# EAGLE design db9tg (EAGLE 9.0.0)
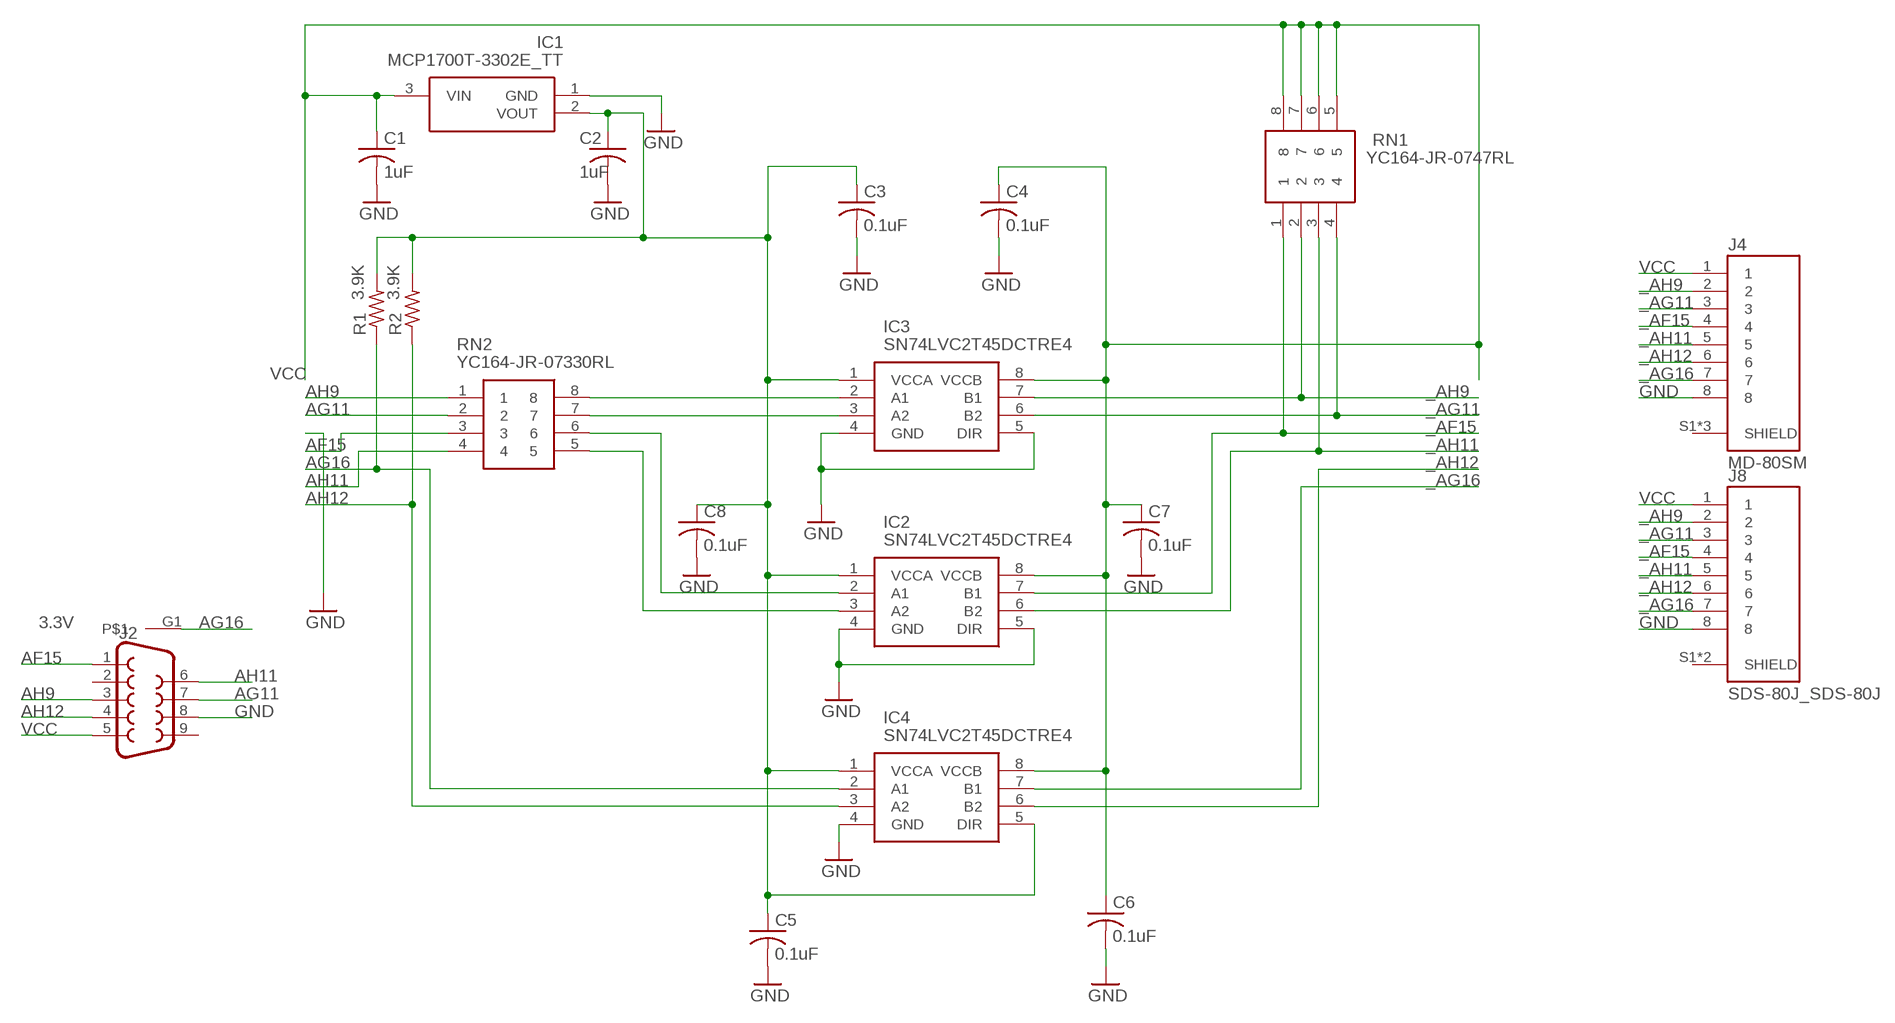
[diagram p0: schematic, sheet 1]

## Parts
C1  1uF  C-USC0603  [C0603]
C2  1uF  C-USC0603  [C0603]
C3  0.1uF  C-USC0402  [C0402]
C4  0.1uF  C-USC0402  [C0402]
C5  0.1uF  C-USC0402  [C0402]
C6  0.1uF  C-USC0402  [C0402]
C7  0.1uF  C-USC0402  [C0402]
C8  0.1uF  C-USC0402  [C0402]
IC1  MCP1700T-3302E_TT  [SOT95P237X112-3N]
IC2  SN74LVC2T45DCTRE4  [SOP65P400X130-8N]
IC3  SN74LVC2T45DCTRE4  [SOP65P400X130-8N]
IC4  SN74LVC2T45DCTRE4  [SOP65P400X130-8N]
J2  DB9FEMALE  [DB9]
J4  MD-80SM  [CUI_MD-80SM]
J8  SDS-80J_SDS-80J  [SDS-80J_CUI_SDS-80J]
R1  3.9K  R-US_R0402  [R0402]
R2  3.9K  R-US_R0402  [R0402]
RN1  YC164-JR-0747RL  YC164-JR-07330RL  [YC164JR07220RL]
RN2  YC164-JR-07330RL  [YC164JR07220RL]

## Nets
3V3: C2.1 C3.1 C5.1 C8.1 IC1.2(VOUT) IC2.1(VCCA) IC3.1(VCCA) IC4.1(VCCA) IC4.5(DIR) R1.2 R2.2
_AF15: IC2.7(B1) J4.4 J8.4 RN1.1
_AG11: IC3.6(B2) J4.3 J8.3 RN1.4
_AG16: IC4.7(B1) J4.7 J8.7
_AH9: IC3.7(B1) J4.2 J8.2 RN1.2
_AH11: IC2.6(B2) J4.5 J8.5 RN1.3
_AH12: IC4.6(B2) J4.6 J8.6
AF15: J2.1 RN2.3
AG11: J2.7 RN2.2
AG16: IC4.2(A1) J2.G1 R1.1
AH9: J2.3 RN2.1
AH11: J2.6 RN2.4
AH12: IC4.3(A2) J2.4 R2.1
GND [power]: C1.2 C2.2 C3.2 C4.2 C5.2 C6.2 C7.2 C8.2 IC1.1(GND) IC2.4(GND) IC2.5(DIR) IC3.4(GND) IC3.5(DIR) IC4.4(GND) J2.8 J4.8 J8.8
N$4: IC3.3(A2) RN2.7
N$6: IC3.2(A1) RN2.8
N$13: IC2.2(A1) RN2.6
N$16: IC2.3(A2) RN2.5
VCC: C1.1 C4.1 C6.1 C7.1 IC1.3(VIN) IC2.8(VCCB) IC3.8(VCCB) IC4.8(VCCB) J2.5 J4.1 J8.1 RN1.5 RN1.6 RN1.7 RN1.8
Unconnected: J2.2 J2.9 J4.S1(SHIELD) J4.S2(SHIELD) J4.S3(SHIELD) J8.S1(SHIELD) J8.S2(SHIELD)

## Library data of the parts
C1 C2 = rcl:C-US: CAPACITOR, American symbol; SPICEPREFIX: C
C3-C8 = resistor:C-US: CAPACITOR, American symbol
IC1 = PC-Engine:MCP1700T-3302E_TT: LDO voltage regulator 250mA Isupply 1uA Source: Datasheet <http://docs-emea.rs-online.com/webdocs/0dd1/0900766b80dd189b.pdf>; ARROW_PART_NUMBER: MCP1700T-3302E/TT; ARROW_PRICE-STOCK: https://www.arrow.com/en/products/mcp1700t-3302ett/microchip-technology; DESCRIPTION: LDO voltage regulator 250mA Isupply 1uA; HEIGHT: 1.12mm; MANUFACTURER_NAME: Microchip; MANUFACTURER_PART_NUMBER: MCP1700T-3302E/TT; MOUSER_PART_NUMBER: 579-MCP1700T3302E/TT; MOUSER_PRICE-STOCK: https://www.mouser.co.uk/ProductDetail/Microchip-Technology/MCP1700T-3302E-TT?qs=fM4xO01eazPmCNDrdHEdaw%3D%3D
IC2-IC4 = PC-Engine:SN74LVC2T45DCTRE4: Translation - Voltage Levels DUAL-BIT DUAL SUPPLY TRANSCEIVER Source: Datasheet <http://www.ti.com/lit/ds/symlink/sn74lvc2t45.pdf>; ARROW_PART_NUMBER: SN74LVC2T45DCTRE4; ARROW_PRICE-STOCK: https://www.arrow.com/en/products/sn74lvc2t45dctre4/texas-instruments; DESCRIPTION: Translation - Voltage Levels DUAL-BIT DUAL SUPPLY TRANSCEIVER; HEIGHT: 1.3mm; MANUFACTURER_NAME: Texas Instruments; MANUFACTURER_PART_NUMBER: SN74LVC2T45DCTRE4; MOUSER_PART_NUMBER: 595-SN74LVC2T45DCTE4; MOUSER_PRICE-STOCK: https://www.mouser.co.uk/ProductDetail/Texas-Instruments/SN74LVC2T45DCTRE4?qs=0smPjiIwnfKw%252BKTYvzl10g%3D%3D
J2 = SparkFun-Connectors:DB9: DB9 Connector Standard DB9 (D-Sub 9) serial connector. Can be used for CAN bus as well as RS485 and RS232. Footprint production proven. Here is the female version connector we sell at SparkFun: 9 Pin Female Serial Connector - PCB Mount <https://www.sparkfun.com/products/429> (PRT-00429) This connector has been used on the following SparkFun products: SparkFun RS232 Shifter - SMD <https://www.sparkfun.com/products/449> (PRT-00449) SparkFun RS232 Shifter SMD (No DB9) <https://www.sparkfun.com/products/8780> (PRT-08780); PROD_ID: CONN-08194
J4 = MD-80SM-edit:MD-80SM: MD-XXSM Series 8 Pin Female Right Angle Shielded Side Mini DIN Connector; CUI_PURCHASE_URL: https://www.cui.com/product/interconnect/connectors/din-connectors/md-sm-series?utm_source=snapeda.com&utm_medium=referral&utm_campaign=snapedaBOM; DESCRIPTION: 3~9 Positions, Receptacle, Right Angle, Through Hole, Shielded, Mini Circular DIN Connector; DIGI-KEY_PART_NUMBER: CP-2280-ND; DIGI-KEY_PURCHASE_URL: https://www.digikey.com/product-detail/en/cui-inc/MD-80SM/CP-2280-ND/96944?utm_source=snapeda&utm_medium=aggregator&utm_campaign=symbol; MF: CUI Inc.; MP: MD-80SM; PACKAGE: None
J8 = db9tg:SDS-80J_SDS-80J: Standard Din Connector 8 Pin, Right-Angle Receptacle; AVAILABILITY: Unavailable; CUI_PURCHASE_URL: https://www.cui.com/product/interconnect/connectors/din-connectors/sds-j-series?utm_source=snapeda.com&utm_medium=referral&utm_campaign=snapedaBOM; DESCRIPTION: 3~13 Positions, Receptacle, Right Angle, Through Hole, Standard Circular DIN Connector; MF: CUI Inc.; MP: SDS-80J; PACKAGE: None; PRICE: None
R1 R2 = resistor:R-US_: RESISTOR, American symbol
RN1 RN2 = SamacSys_Parts:YC164-JR-07330RL: YAGEO - YC164-JR-07330RL - RESISTOR ARRAY, ARV241 1206 330R Source: Datasheet <https://media.digikey.com/pdf/Data Sheets/Yageo PDFs/YC102-358,TC122-164_Series_DS.pdf>; DESCRIPTION: YAGEO - YC164-JR-07330RL - RESISTOR ARRAY, ARV241 1206 330R; HEIGHT: 0mm; MANUFACTURER_NAME: YAGEO (PHYCOMP); MANUFACTURER_PART_NUMBER: YC164-JR-07330RL; MOUSER_PART_NUMBER: 603-YC164-JR-07330RL; MOUSER_PRICE-STOCK: https://www.mouser.com/Search/Refine.aspx?Keyword=603-YC164-JR-07330RL

## Net classes
1 power: width 0.305 mm

## Board
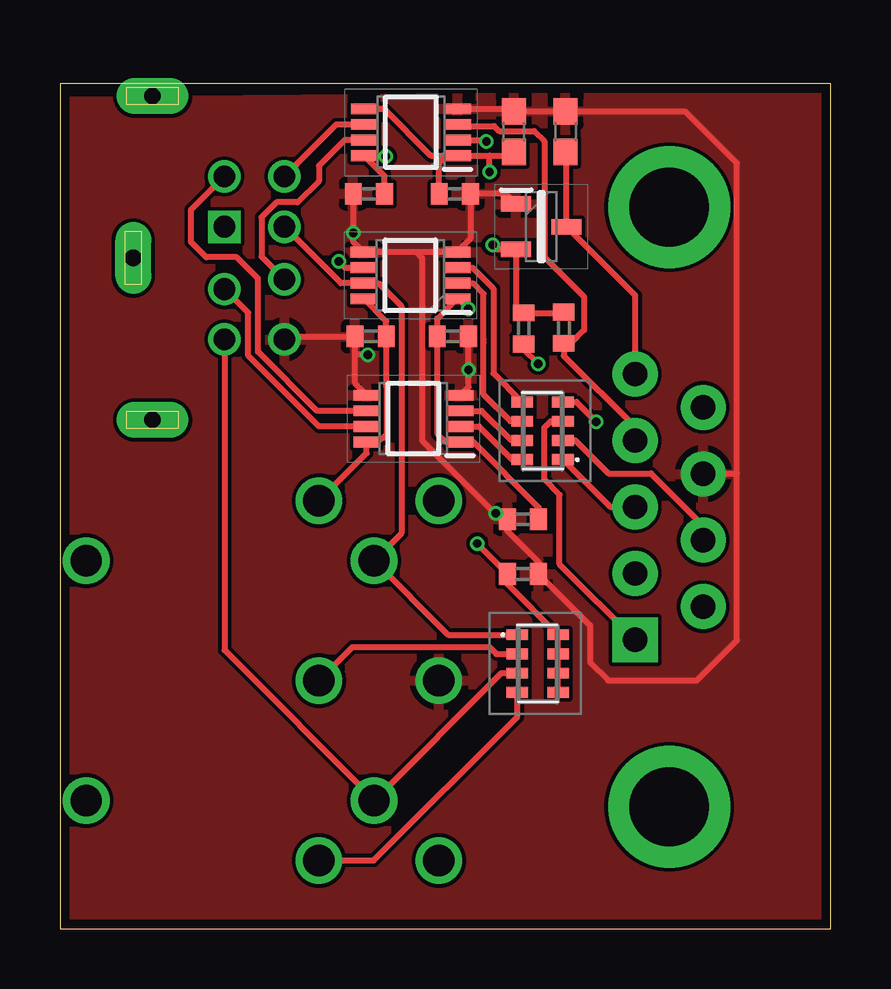
[diagram p1: board, top side]
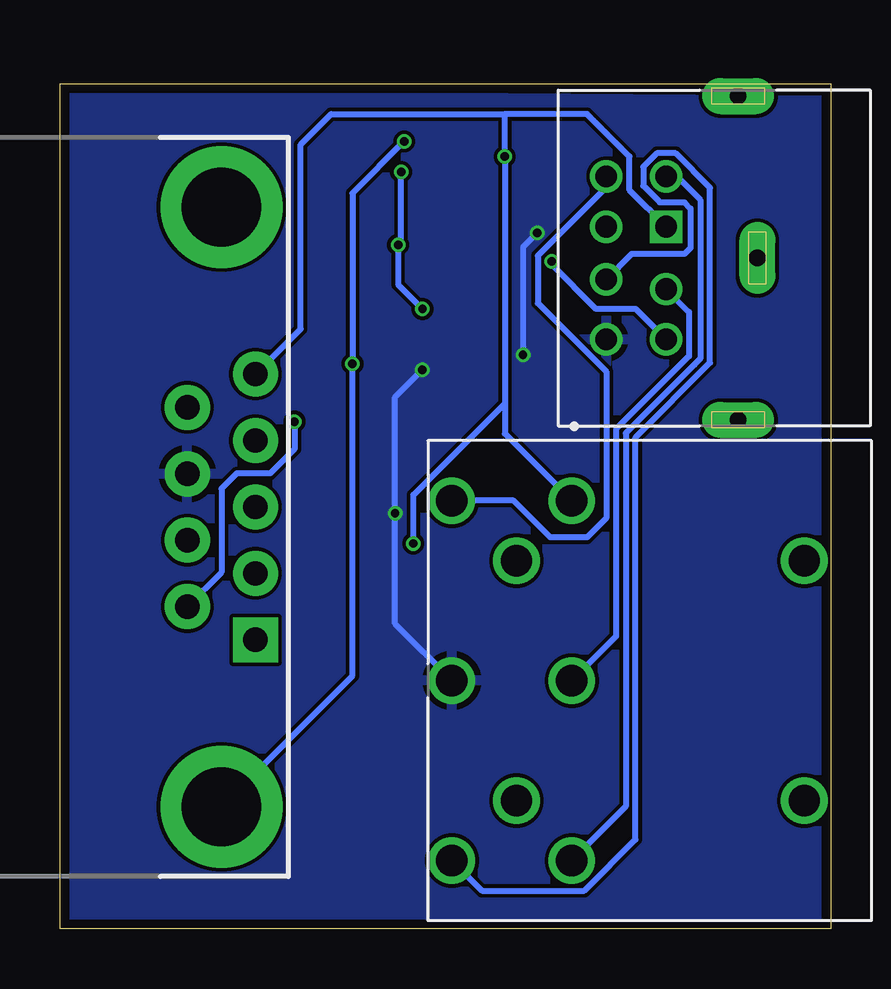
[diagram p2: board, bottom side, seen from below]

Size 32.13 x 35.23 mm. Coordinates in mm from the lower left corner, seen from the top.
Outline: 32.13,35.23 0,35.23 0,0 32.13,0 32.13,35.23
Copper layers (1*16): Top 0.035559375mm / dielectric 1.6mm / Bottom 0.035559375mm
Design rules "oshpark-2layer *": minimum track width 6mil, minimum drill 10mil, track to track 6mil, track to pad 6mil, pad to pad 6mil, via to via 6mil, smd to smd 6mil, copper to edge 15mil, drill to drill 6mil, minimum pad ring 5mil, minimum via ring 5mil, stop-mask expansion 2.5mil, vias tented up to drill 15mil, thermal gap 10mil

### Footprints (pad centres in the part's own frame; a part is rotated, then mirrored left to right if it is on the bottom)
C0603 = smd 1.1 x 1: 1 -0.85,0; 2 0.85,0
C0402 = smd 0.7 x 0.9: 1 -0.65,0; 2 0.65,0
SOT95P237X112-3N = smd 1.25 x 0.65: 1 -1.05,0.95; 2 -1.05,-0.95; 3 1.05,0
SOP65P400X130-8N = smd 1.1 x 0.45: 1 -1.95,0.975; 2 -1.95,0.325; 3 -1.95,-0.325; 4 -1.95,-0.975; 5 1.95,-0.975; 6 1.95,-0.325; 7 1.95,0.325; 8 1.95,0.975
DB9 = drill 1.016 pad 1.88 square: 1 -5.54,-1.42 | drill 1.016 pad 1.88: 2 -2.77,-1.42; 3 0,-1.42; 4 2.77,-1.42; 5 5.54,-1.42; 6 -4.15,1.42; 7 -1.38,1.42; 8 1.38,1.42; 9 4.15,1.42 | drill 3.302 pad 5.08: G1 -12.5,0; G2 12.5,0
CUI_MD-80SM = drill 0.9 square: 1 0,0 | drill 0.9: 2 2.6,0; 3 -2.1,0; 4 0,-2.5; 5 4.7,0; 6 -2.1,-2.5; 7 2.2,-2.5; 8 4.7,-2.5 | drill 0.7 pad 1.5 long: S1 -5.45,3; S2 8.05,3; S3 1.3,3.8
SDS-80J_CUI_SDS-80J = drill 1.3: 1 7.5,0; 2 0,0; 3 -7.5,0; 4 5,2.3; 5 -5,2.3; 6 7.5,5; 7 -7.5,5; 8 0,5; S1 -5,-9.7; S2 5,-9.7
R0402 = smd 0.7 x 0.9: 1 -0.65,0; 2 0.65,0
YC164JR07220RL = smd 0.45 x 0.9: 1 -1.2,-0.85; 2 -0.4,-0.85; 3 0.4,-0.85; 4 1.2,-0.85; 5 1.2,0.85; 6 0.4,0.85; 7 -0.4,0.85; 8 -1.2,0.85

### Placement (x,y rotation side)
C1  21.08,33.22 90 top
C2  18.92,33.22 90 top
C3  19.3,17.07 180 top
C4  19.3,14.78 0 top
C5  16.46,30.63 0 top
C6  12.88,30.63 180 top
C7  12.95,24.69 180 top
C8  16.38,24.69 0 top
IC1  20.07,29.26 0 top
IC2  14.61,27.23 180 top
IC3  14.73,21.26 180 top
IC4  14.63,33.2 180 top
J2  25.4,17.58 90 bottom
J4  6.86,29.26 270 bottom
J8  10.8,10.34 90 bottom
R1  19.33,25.02 90 top
R2  21.01,25.04 90 top
RN1  19.91,11.05 270 top
RN2  20.12,20.75 90 top

### Tracks (layer width: path | path; a pad name or v marks a point on that pad's centre or on a via)
3V3  (via drill 0.35)
  Top 0.254: IC4.5 13.5,34.17 15.45,32.22 16.13,32.22 | 16.13,32.22 IC4.1 17.91,32.22 | 17.91,32.22 18.77,32.22 C2.1 | R2.2 20.98,25.67 R1.2 19.02,25.98 IC1.2 18.22,28.31 v18.03,28.5 | C5.1 15.81,31.9 16.13,32.22 | C3.1 19.95,17.56 17.23,20.29 IC3.1 16.09,20.29 15.75,20.62 15.75,24.67 C8.1 15.73,25.43 IC2.1 16.6,26.25 v17.02,25.83 | v17.91,31.55 17.91,32.22
  Bottom 0.254: v17.91,31.55 17.91,28.63 v18.03,28.5 18.03,26.85 v17.02,25.83
_AF15
  Top 0.254: J4.4 11.71,26.9 IC2.7 13.28,26.9 14.23,25.95 14.23,16.48 J8.4 16.18,12.25 RN1.1
_AG11
  Top 0.254: J8.3 13.07,2.84 19.06,8.83 RN1.4 | IC3.6 10.72,21.59 8.25,24.05 8.25,27.1 7.37,27.99 6.1,27.99 5.46,28.63 5.46,29.96 J4.3
  Bottom 0.254: J8.3 8.55,5.09 8.55,20.65 5.68,23.51 5.5,23.7 5.44,23.76 5.44,30.38 6.42,31.36 J4.3
_AG16
  Top 0.254: IC4.7 11.87,32.87 10.8,31.8 10.8,31.17 9.91,30.28 9.02,30.28 8.4,29.66 8.4,28.02 J4.7
  Bottom 0.254: J4.7 8.3,28.12 6.1,28.12 5.84,28.37 5.84,30.02 6.1,30.28 7.12,30.28 7.81,30.97 7.81,31.76 7.25,32.31 6.46,32.31 5.03,30.88 5.03,23.59 8.14,20.48 8.14,3.72 10.27,1.58 14.54,1.58 J8.7
_AH9
  Top 0.254: J8.2 12.19,11.73 17.91,11.73 18.19,11.45 RN1.2 | IC3.7 10.8,20.94 7.85,23.89 7.85,25.67 J4.2
  Bottom 0.254: J4.2 5.9,25.71 5.9,23.87 8.95,20.82 8.95,12.18 J8.2
_AH11  (via drill 0.35)
  Top 0.254: J8.5 13.11,5.36 | 13.11,5.36 18.41,10.65 RN1.3 | v11.63,27.81 11.89,27.55 IC2.6 | J4.5 6.86,11.61 13.11,5.36
  Bottom 0.254: J4.5 8.13,25.83 9.78,25.83 11.63,27.68 v11.63,27.81
_AH12
  Top 0.254: IC4.6 11.52,33.52 J4.6
  Bottom 0.254: J4.6 9.36,30.91 12.21,28.05 12.21,26.06 9.36,23.21 9.36,17.11 10.16,16.31 11.68,16.31 13.21,17.84 J8.6
AF15
  Top 0.254: J2.1 20.83,15.19 20.83,18.09 20.19,18.72 20.19,20.88 20.47,21.15 RN2.3
AG11
  Top 0.254: RN2.2 21.48,20.35 22.86,18.97 24.64,18.97 26.82,16.79 J2.7
AG16  (via drill 0.35)
  Top 0.254: IC4.2 17.72,32.87 v17.78,32.82 | v19.94,23.55 19.33,24.16 R1.1
  Bottom 0.254: v17.78,32.82 19.94,30.66 v19.94,23.55 19.94,10.54 J2.G1
AH9
  Top 0.254: RN2.1 22.94,17.58 J2.3
AH11  (via drill 0.35)
  Top 0.254: RN2.4 21.53,21.95 v22.35,21.13
  Bottom 0.254: v22.35,21.13 22.35,19.99 23.37,18.97 24.77,18.97 25.4,18.34 25.4,14.85 J2.6
AH12
  Top 0.254: J2.4 23.98,20.9 21.01,23.88 R2.1 21.3,24.4 21.84,24.94 21.84,26.34 20.19,27.99 20.19,32.82 19.77,33.24 18.31,33.24 18.1,33.45 16.65,33.45 IC4.3
GND  (via drill 0.35)
  Top 0.254: IC4.4 18.82,34.17 C2.2 C1.2 26.05,34.07 28.22,31.9 28.22,18.97 | IC1.1 18.59,30.63 C5.2 17.11,28.76 IC2.4 14.86,28.2 | 14.86,28.2 IC2.5 12.23,28.63 v12.23,29.01 C6.2 | IC3.5 12.3,22.71 12.3,23.93 | 12.3,23.93 C7.2 9.49,24.69 J4.8 | IC3.4 17.03,22.59 v17.03,23.29 C8.2 | 14.86,28.2 15.1,27.96 15.1,20.34 18.01,17.43 18.12,17.32 | v12.83,23.93 12.3,23.93 | 18.12,17.32 18.37,17.07 C3.2 18.65,16.58 19.95,15.28 C4.2 22.1,12.64 22.1,11.1 22.86,10.34 26.54,10.34 28.22,12.01 28.22,18.97 | J2.8 26.84,18.97 28.22,18.97 | 18.12,17.32 v18.16,17.32
  Bottom 0.254: v12.23,29.01 12.83,28.41 v12.83,23.93 | J8.8 18.16,12.7 v18.16,17.32 18.16,22.16 v17.03,23.29
  pour Bottom: 31.7,0.44 0.55,0.38 0.43,34.52 31.71,34.76
  pour Top: 31.77,34.77 31.75,0.48 0.52,0.51 0.4,34.5
N$4
  Top 0.254: IC3.3 17.58,21.59 18.81,20.35 RN2.7
N$6
  Top 0.254: IC3.2 17.47,20.94 18.85,19.55 RN2.8
N$13
  Top 0.254: IC2.2 17.22,26.9 17.66,26.46 17.66,24.56 17.66,24.44 17.66,22.27 18.78,21.15 RN2.6
N$16
  Top 0.254: IC2.3 17.2,27.55 18.07,26.69 18.07,23.15 RN2.5
VCC  (via drill 0.35)
  Top 0.254: C1.1 21.12,32.34 IC1.3 23.98,26.4 J2.5 | IC2.8 13.6,25.3 C7.1 13.6,22.58 13.61,22.58 13.61,20.59 13.45,20.43 13.39,20.43 13.25,20.29 IC3.8 12.78,19.82 J8.1 | C6.1 13.53,31.38 IC4.8 13.55,32.22 v13.59,32.18 | RN1.5 RN1.6 RN1.7 RN1.8 18.65,14.36 C4.1 17.4,16.04 v17.4,16.05
  Bottom 0.254: J2.5 22.1,25 22.1,32.69 20.83,33.96 13.59,33.96 | 6.99,29.26 J4.1 8.38,30.78 8.38,32.18 10.16,33.96 13.59,33.96 | 13.59,33.96 v13.59,32.18 13.59,21.89 | 13.59,21.89 13.59,20.63 J8.1 | v17.4,16.05 17.4,18.09 13.59,21.89